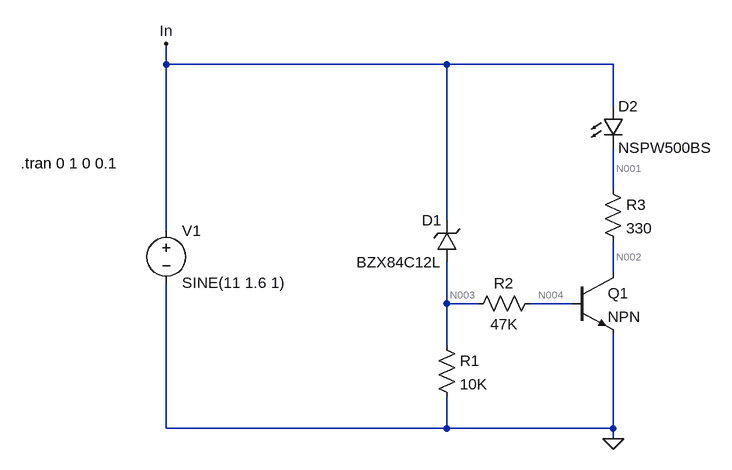
[diagram p0: schematic Transistor ckt for bat full charge.asc]
Transistor ckt for bat full charge.asc, the LTspice schematic file:
Version 4
SHEET 1 880 680
WIRE -496 -208 -496 -240
WIRE -64 -208 -496 -208
WIRE 192 -208 -64 -208
WIRE 192 -144 192 -208
WIRE 192 -16 192 -80
WIRE -64 32 -64 -208
WIRE -496 48 -496 -208
WIRE 192 112 192 64
WIRE -64 160 -64 96
WIRE -16 160 -64 160
WIRE 128 160 64 160
WIRE -64 224 -64 160
WIRE -496 352 -496 128
WIRE -64 352 -64 304
WIRE -64 352 -496 352
WIRE 192 352 192 208
WIRE 192 352 -64 352
WIRE 192 368 192 352
FLAG 192 368 0
FLAG -496 -240 In
SYMBOL npn2 128 112 R0
SYMATTR InstName Q1
SYMBOL res -80 208 R0
SYMATTR InstName R1
SYMATTR Value 10K
SYMBOL res 80 144 R90
WINDOW 0 0 56 VBottom 2
WINDOW 3 32 56 VTop 2
SYMATTR InstName R2
SYMATTR Value 47K
SYMBOL zener -48 96 R180
WINDOW 0 24 64 Left 2
WINDOW 3 24 0 Left 2
SYMATTR InstName D1
SYMATTR Value BZX84C12L
SYMATTR Description Diode
SYMATTR Type diode
SYMBOL LED 176 -144 R0
SYMATTR InstName D2
SYMATTR Value NSPW500BS
SYMATTR Description Diode
SYMATTR Type diode
SYMBOL res 176 -32 R0
SYMATTR InstName R3
SYMATTR Value 330
SYMBOL voltage -496 32 R0
SYMATTR InstName V1
SYMATTR Value SINE(11 1.6 1)
TEXT -720 -56 Left 2 !.tran 0 1 0 0.1

The netlist it stands for:
* Transistor ckt for bat full charge.asc
Q1 N002 N004 0 0 NPN
R1 N003 0 10K
R2 N004 N003 47K
D1 N003 In BZX84C12L
D2 In N001 NSPW500BS
R3 N001 N002 330
V1 In 0 SINE(11 1.6 1)
.model D D
.lib standard.dio
.model NPN NPN
.model PNP PNP
.lib standard.bjt
.tran 0 1 0 0.1
.backanno
.end

* Results of the author's LTspice run, read from the files saved beside the schematic
* Operating Point, zero values left out:
*   V(n002) = 10.99 V
*   V(n004) = 4.249 mV
*   V(n003) = 4.248 mV
*   V(in) = 11 V
*   V(n001) = 10.99 V
*   Ic(Q1) = 10.99 pA
*   Ib(Q1) = -10.98 pA
*   I(D2) = 10.99 pA
*   I(D1) = -424.8 nA
*   I(R3) = 10.99 pA
*   I(R2) = 10.98 pA
*   I(R1) = 424.8 nA
*   I(V1) = -424.8 nA
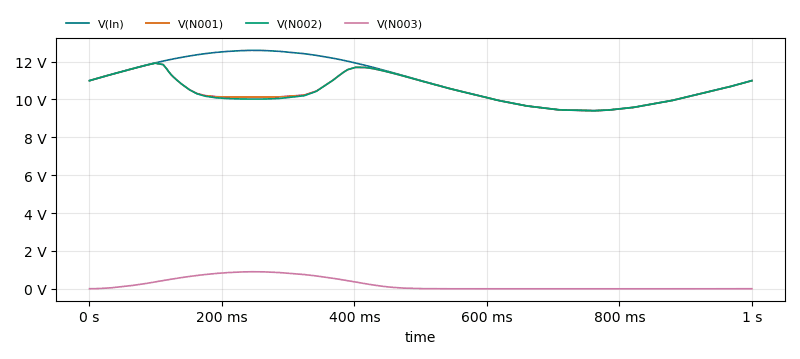
[diagram p1: Transient Analysis of Transistor ckt for bat full charge.asc, plotted from the saved traces]
* Transient Analysis, 1 run:
*   V(In): min 9.412 V, max 12.59 V, average 11.01 V, rms 11.07 V, last 11 V
*   V(N001): min 9.406 V, max 11.92 V, average 10.46 V, rms 10.48 V, last 10.99 V
*   V(N002): min 9.406 V, max 11.92 V, average 10.45 V, rms 10.47 V, last 10.99 V
*   V(N003): min 4.025 µV, max 901.4 mV, average 241.1 mV, rms 407.2 mV, last 4.252 mV